# EAGLE design coreAdapter (EAGLE 5.06)
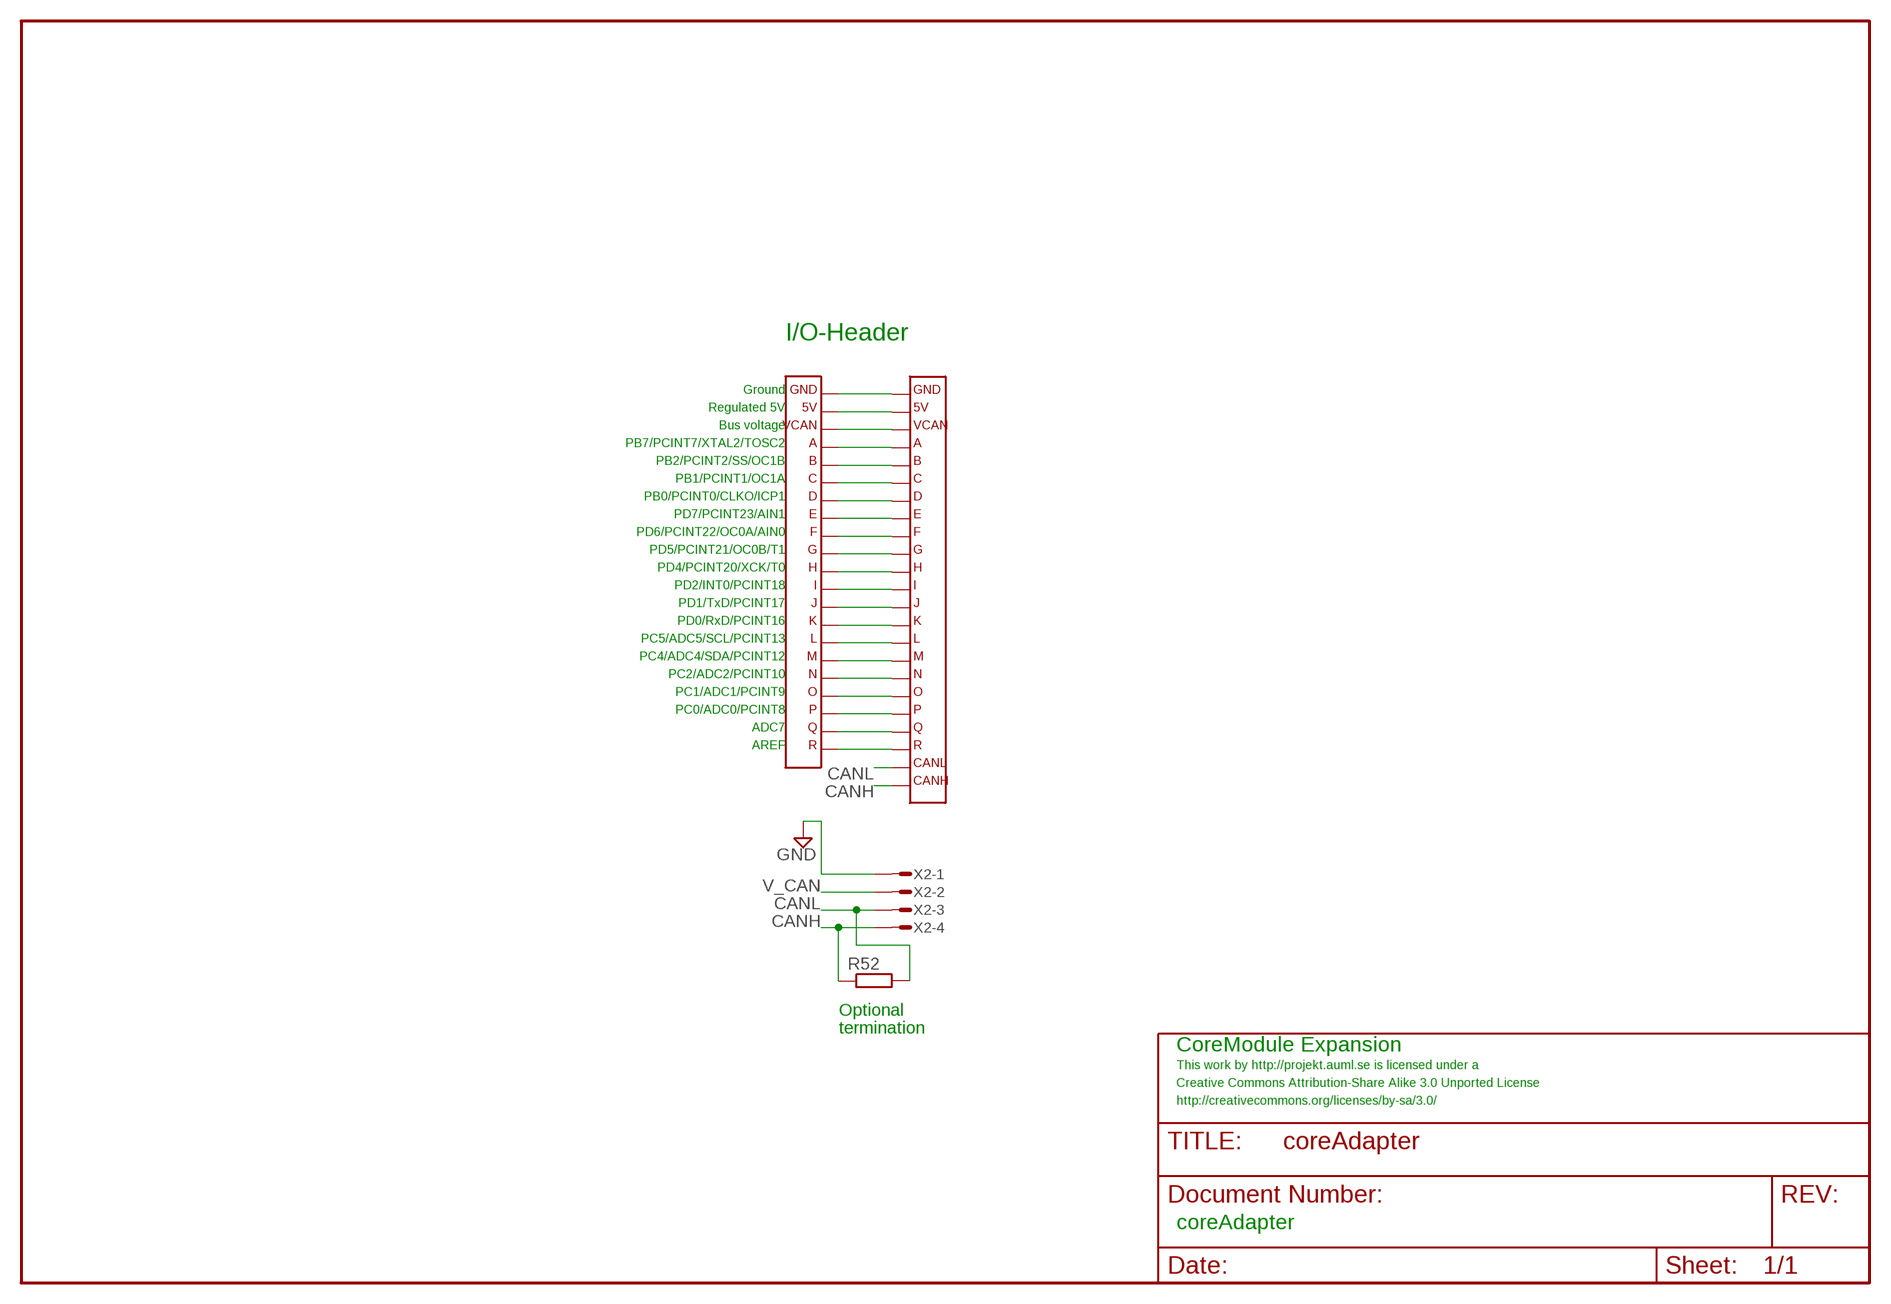
[diagram p0: schematic, sheet 1]

## Parts
R52  R-EUR0603  [R0603]
X1  CORETWO_LAYOUTALLHOLES  [CORETWO_LAYOUT]
X2  MICROMATCH-4  [MICROMATCH-4]
X3  CORE_IOHEADEXP  [CORE_IOHEAD_NOSILC]

## Nets
CANH: R52.1 X1.CANH X2.4
CANL: R52.2 X1.CANL X2.3
EXP_A: X1.A X3.4
EXP_B: X1.B X3.5
EXP_C: X1.C X3.6
EXP_D: X1.D X3.7
EXP_E: X1.E X3.8
EXP_F: X1.F X3.9
EXP_G: X1.G X3.10
EXP_H: X1.H X3.11
EXP_I: X1.I X3.12
EXP_J: X1.J X3.13
EXP_K: X1.K X3.14
EXP_L: X1.L X3.15
EXP_M: X1.M X3.16
EXP_N: X1.N X3.17
EXP_O: X1.O X3.18
EXP_P: X1.P X3.19
EXP_Q: X1.Q X3.20
EXP_R: X1.R X3.21
GND: X1.GND X2.1 X3.1
V_CAN: X1.VCAN X2.2 X3.3
VCC: X1.5V X3.2

## Notes on the sheet
- I/O-Header
- Ground
- Regulated 5V
- Bus voltage
- PB7/PCINT7/XTAL2/TOSC2
- PB2/PCINT2/SS/OC1B
- PB1/PCINT1/OC1A
- PB0/PCINT0/CLKO/ICP1
- PD7/PCINT23/AIN1
- PD6/PCINT22/OC0A/AIN0
- PD5/PCINT21/OC0B/T1
- PD4/PCINT20/XCK/T0
- PD2/INT0/PCINT18
- PD1/TxD/PCINT17
- PD0/RxD/PCINT16
- PC5/ADC5/SCL/PCINT13
- PC4/ADC4/SDA/PCINT12
- PC2/ADC2/PCINT10
- PC1/ADC1/PCINT9
- PC0/ADC0/PCINT8
- ADC7
- AREF
- Optional
- termination
- CoreModule Expansion
- This work by http://projekt.auml.se is licensed under a
- Creative Commons Attribution-Share Alike 3.0 Unported License
- http://creativecommons.org/licenses/by-sa/3.0/
- coreAdapter

## Library data of the parts
R52 = rcl:R-EU
X1 = expboard:CORETWO_LAYOUT
X2 = con-amp-micromatch:MICROMATCH-4: MicroMaTch 4 7-215464-4 / 0-215464-4 Drawing Number C-215464 DDEController.pdf
X3 = expboard:CORE_IOHEAD: CoreCard IO-header for expansion cards

## Board
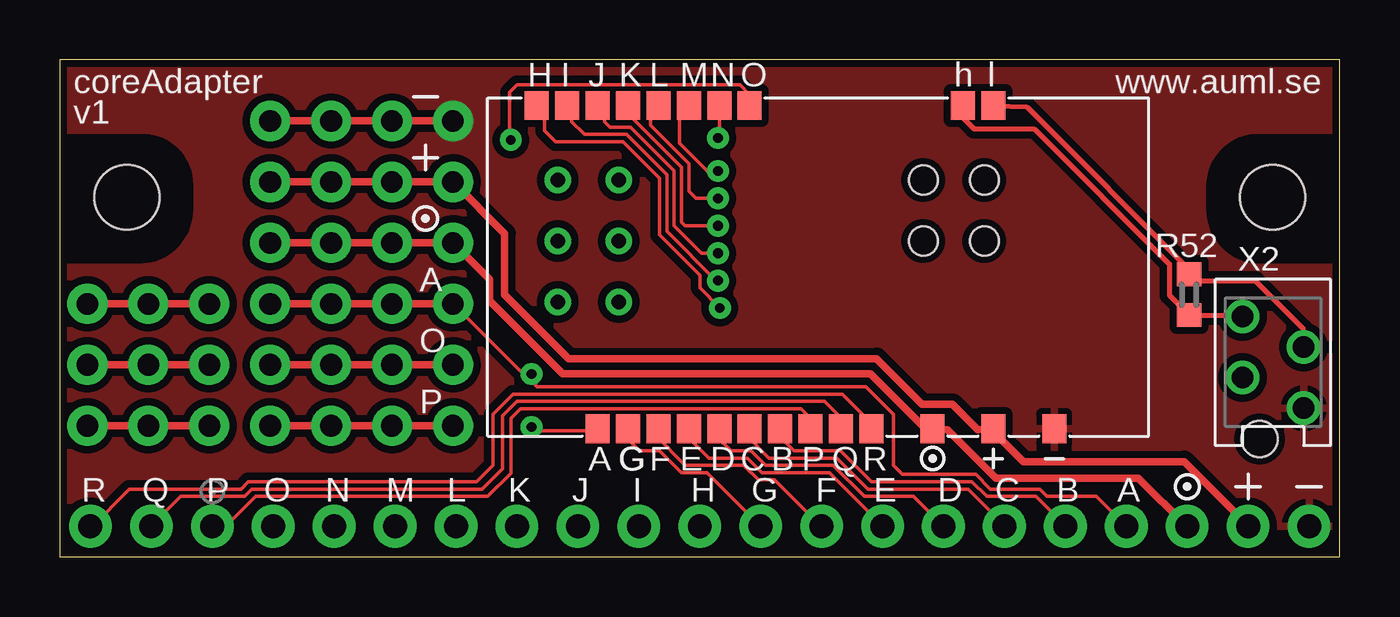
[diagram p1: board, top side]
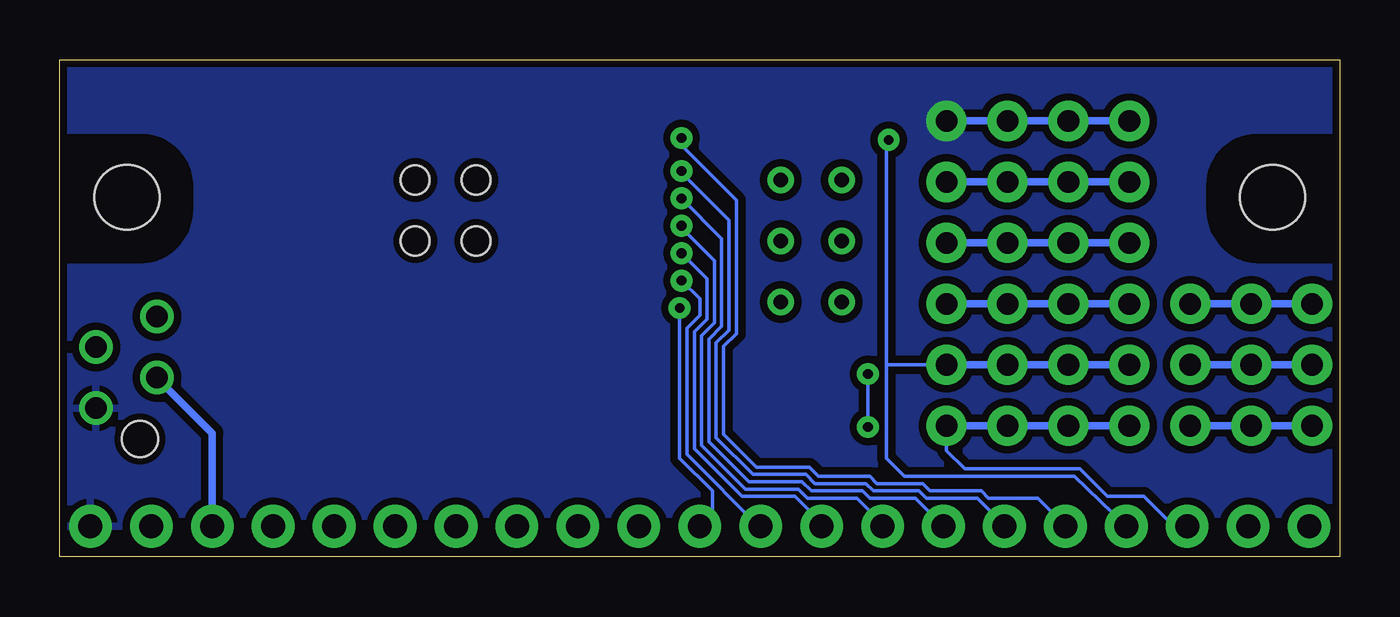
[diagram p2: board, bottom side, seen from below]

Size 53.34 x 20.7 mm. Coordinates in mm from the lower left corner, seen from the top.
Outline: 0,0 53.34,0 53.34,20.7 0,20.7 0,0
Copper layers (1*16): Top 0.035mm / dielectric 1.5mm / Bottom 0.035mm
Design rules "default": minimum track width 6mil, minimum drill 0.4mm, track to track 6mil, track to pad 6mil, pad to pad 6mil, via to via 6mil, smd to smd 6mil, copper to edge 10mil, drill to drill 8mil, minimum pad ring 10mil, minimum via ring 10mil, stop-mask expansion 4mil, vias tented up to drill 18mil, thermal gap 10mil
Holes 2.7 mm at 50.55,14.99 2.79,14.99

### Footprints (pad centres in the part's own frame; a part is rotated, then mirrored left to right if it is on the bottom)
R0603 = smd 0.991 x 1.016: 1 -0.85,0; 2 0.85,0
CORETWO_LAYOUT_CU = smd 1 x 1.2: 5V 7.62,-7.258; A -8.89,-7.258; B -1.27,-7.258; C -2.54,-7.258; CANH 6.35,6.204; CANL 7.62,6.204; D -3.81,-7.258; E -5.08,-7.258; F -6.35,-7.258; G -7.62,-7.258; GND 10.16,-7.258; H -11.43,6.204; I -10.16,6.204; J -8.89,6.204; K -7.62,6.204; L -6.35,6.204; M -5.08,6.204; N -3.81,6.204; O -2.54,6.204; P 0,-7.258; Q 1.27,-7.258; R 2.54,-7.258; VCAN 5.08,-7.258 | drill 0.6 round: P$1 -10.541,3.099; P$2 -8.001,3.099; P$3 -10.541,0.559; P$4 -8.001,0.559; P$5 -8.001,-1.981; P$6 -10.541,-1.981 | hole 1.2: 4.699,3.099; 7.239,3.099; 7.239,0.559; 4.699,0.559
MICROMATCH-4 = drill 0.9 round: 1 1.905,1.27; 2 0.635,-1.27; 3 -0.635,1.27; 4 -1.905,-1.27 | hole 1.5: 3.199,-0.562
CORE_IOHEAD_NOSILC = drill 1 pad 1.778 round: 1 25.4,0; 2 22.86,0; 3 20.32,0; 4 17.78,0; 5 15.24,0; 6 12.7,0; 7 10.16,0; 8 7.62,0; 9 5.08,0; 10 2.54,0; 11 0,0; 12 -2.54,0; 13 -5.08,0; 14 -7.62,0; 15 -10.16,0; 16 -12.7,0; 17 -15.24,0; 18 -17.78,0; 19 -20.32,0; 20 -22.86,0; 21 -25.4,0

### Placement (x,y rotation side)
R52  47.07,10.92 90 top
X1  CORETWO_LAYOUTALLHOLES_CU  [CORETWO_LAYOUT_CU]  31.29,12.6 0 top
X2  50.57,8.1 270 top
X3  26.67,1.27 180 bottom

### Tracks (layer width: path | path; a pad name or v marks a point on that pad's centre or on a via)
CANH
  Top 0.203: X1.CANH 37.64,18.29 38.1,17.83 40.62,17.83 46.25,12.19 46.25,10.9 R52.1 | R52.1 47.09,10.06 | R52.1 49.13,10.07 49.23,9.98 49.25,10.01 X2.4
CANL
  Top 0.203: X1.CANL 40.3,18.75 47.17,11.89 47.07,11.79 R52.2 47.32,11.51 49.84,11.51 51.82,9.53 51.82,8.84 51.89,8.76 51.87,8.74 X2.3
EXP_A  (via drill 0.4 pad 0.25)
  Top 0.152: X1.A 22.36,5.29 22.33,5.26 19.81,5.26 v19.66,5.41 | X3.4 43.2,2.52 41.15,2.52 40.84,2.82 38.79,2.82 38.18,3.43 35.13,3.43 34.75,3.81 34.75,5.94 33.6,7.09 19.89,7.09 19.66,7.32 v19.66,7.62 19.66,7.26 16.38,10.54
  Top 0.305: 16.38,10.54 13.84,10.54
  Bottom 0.152: v19.66,5.41 v19.66,7.62
EXP_B
  Top 0.152: X1.B 30.02,5 30.61,4.42 32.54,4.42 33.83,3.12 38.02,3.12 38.63,2.52 40.69,2.52 41.91,1.29 X3.5
EXP_C
  Top 0.152: X1.C 28.63,5.05 29.57,4.12 32.38,4.12 33.68,2.82 37.87,2.82 39.4,1.29 X3.6
EXP_D
  Top 0.152: X1.D 27.36,5.03 27.96,4.42 28.8,4.42 29.41,3.81 32.23,3.81 33.53,2.52 35.59,2.52 X3.7 36.88,1.22
EXP_E
  Top 0.152: X1.E 26.16,5 27.05,4.12 28.65,4.12 29.26,3.5 32.08,3.5 34.29,1.29 X3.8
EXP_F
  Top 0.152: X1.F 24.82,5.05 26.06,3.81 28.5,3.81 29.11,3.2 29.79,3.2 31.75,1.25 | 31.75,1.25 31.77,1.22 | 31.75,1.25 X3.9
EXP_G
  Top 0.152: X1.G 23.55,5.03 24.16,4.42 24.99,4.42 25.91,3.5 26.98,3.5 X3.10
EXP_H  (via drill 0.4 pad 0.25)
  Top 0.152: X1.H 19.86,18.62 20.19,18.29 20.19,17.75 20.65,17.3 23.47,17.3 24.99,15.77 24.99,13.41 26.67,11.73 26.67,11.2 v27.51,10.36
  Bottom 0.152: X3.11 26.67,1.29 26.14,1.75 26.14,2.74 27.51,4.12 v27.51,10.36
EXP_I  (via drill 0.4 pad 0.25)
  Top 0.152: X1.I 21.13,18.49 21.34,18.29 21.34,18.14 21.87,17.6 23.62,17.6 25.3,15.93 25.3,13.56 27.36,11.51 v27.43,11.51
  Bottom 0.152: v27.43,11.51 26.67,10.74 26.67,10.06 27.2,9.53 27.2,4.27 24.16,1.22 24.13,1.25 X3.12
EXP_J  (via drill 0.4 pad 0.25)
  Top 0.152: X1.J 22.4,18.59 22.71,18.29 22.71,18.14 22.94,17.91 23.77,17.91 25.6,16.08 25.6,13.79 26.75,12.65 v27.43,12.65
  Bottom 0.152: v27.43,12.65 26.36,11.58 26.36,9.91 26.9,9.37 26.9,4.5 24.92,2.52 22.71,2.52 21.57,1.37 21.59,1.35 X3.13
EXP_K  (via drill 0.4 pad 0.25)
  Top 0.152: X1.K 23.67,18.47 25.91,16.23 25.91,13.95 26.06,13.79 v27.43,13.79
  Bottom 0.152: v27.43,13.79 27.43,13.72 26.06,12.34 26.06,9.75 26.59,9.22 26.59,4.65 24.77,2.82 22.55,2.82 22.17,2.44 20.12,2.44 18.97,1.29 19,1.27 X3.14
EXP_L  (via drill 0.4 pad 0.25)
  Top 0.152: X1.L 24.61,18.42 24.61,17.98 26.21,16.38 26.21,15.24 26.52,14.94 v27.43,14.94
  Bottom 0.152: v27.43,14.94 25.76,13.26 25.76,9.6 26.29,9.07 26.29,4.8 24.61,3.12 22.4,3.12 22.02,2.74 19.89,2.74 19.58,2.44 17.68,2.44 X3.15
EXP_M  (via drill 0.4 pad 0.25)
  Top 0.152: X1.M 26.21,18.67 25.83,18.29 25.83,17.22 26.98,16.08 v27.43,16.08
  Bottom 0.152: v27.43,16.08 27.43,16 25.45,14.02 25.45,9.45 25.98,8.91 25.98,4.95 24.46,3.43 22.25,3.43 21.87,3.05 19.74,3.05 19.43,2.74 17.53,2.74 17.22,2.44 15.09,2.44 13.95,1.29 X3.16
EXP_N  (via drill 0.4 pad 0.25)
  Top 0.152: X1.N 27.48,17.5 v27.43,17.45
  Bottom 0.152: v27.43,17.45 27.43,17.14 25.15,14.86 25.15,9.3 25.68,8.76 25.68,5.11 24.31,3.73 22.1,3.73 21.72,3.35 19.58,3.35 19.28,3.05 17.37,3.05 17.07,2.74 14.94,2.74 14.63,2.44 12.57,2.44 11.43,1.29 X3.17
EXP_O  (via drill 0.4 pad 0.25, 0.9 pad 1.68)
  Top 0.152: X1.O 28.75,19.25 28.35,19.66 19.05,19.66 18.75,19.36 18.75,17.4 18.8,17.4 v18.8,17.37
  Bottom 0.152: X3.18 11.05,3.35 18.14,3.35 18.9,4.12 18.9,8 | v18.8,17.37 18.75,17.37 18.9,17.22 18.9,8 | 18.9,8 v16.38,8
EXP_P  (via drill 0.9 pad 1.68)
  Top 0.152: X1.P 31.42,5.64 30.89,6.17 19.2,6.17 18.8,5.77 18.8,3.48 17.83,2.52 8.15,2.52 6.91,1.27 X3.19
  Bottom 0.152: v16.38,5.46 16.38,4.42 15.62,3.66 10.82,3.66 9.68,2.52 8.15,2.52 6.93,1.29 6.4,1.29 6.38,1.27 X3.19
EXP_Q
  Top 0.152: X1.Q 32.69,5.66 31.88,6.48 19.05,6.48 18.44,5.87 18.44,3.66 17.6,2.82 8,2.82 7.7,2.52 5.03,2.52 3.81,1.29 X3.20
EXP_R
  Top 0.152: X1.R 33.71,5.69 32.61,6.78 18.9,6.78 18.06,5.94 18.06,3.81 17.37,3.12 7.85,3.12 7.54,2.82 2.9,2.82 1.29,1.22 1.27,1.25 X3.21
GND  (via drill 0.9 pad 1.68)
  other vias: 16.38,18.16
  pour Bottom (isolate 0.305, rank 3): 0,20.7 53.34,20.7 53.34,17.78 50.04,17.78 arc90 47.62,15.49 47.62,14.48 arc90 50.04,12.06 53.34,12.06 53.34,1.14 0,1.14 0,12.06 3.3,12.06 arc90 5.71,14.48 5.71,15.49 arc90 3.43,17.78 0,17.78
  pour Top (isolate 0.305, rank 3): 0,20.7 53.34,20.7 53.34,17.78 50.04,17.78 arc90 47.62,15.49 47.62,14.48 arc90 50.04,12.06 53.34,12.06 53.34,1.14 0,1.14 0,12.06 3.3,12.06 arc90 5.71,14.48 5.71,15.49 arc90 3.43,17.78 0,17.78
N$109  (via drill 0.9 pad 1.68)
  other vias: 1.14,10.54
N$110  (via drill 0.9 pad 1.68)
  other vias: 1.14,8
N$111  (via drill 0.9 pad 1.68)
  other vias: 1.14,5.46
N$159  (via drill 0.9 pad 1.68)
  other vias: 3.68,10.54
N$160  (via drill 0.9 pad 1.68)
  other vias: 3.68,8
N$161  (via drill 0.9 pad 1.68)
  other vias: 3.68,5.46
N$178
  Bottom 0.305: 1.14,10.54 3.68,10.54
N$179
  Top 0.305: 1.14,10.54 3.68,10.54
N$180
  Bottom 0.305: 1.14,8 3.68,8
N$181
  Top 0.305: 1.14,8 3.68,8
N$182
  Bottom 0.305: 1.14,5.46 3.68,5.46
N$183
  Top 0.305: 1.14,5.46 3.68,5.46
N$208  (via drill 0.9 pad 1.68)
  other vias: 6.22,10.54
N$209  (via drill 0.9 pad 1.68)
  other vias: 6.22,8
N$210  (via drill 0.9 pad 1.68)
  other vias: 6.22,5.46
N$226
  Bottom 0.305: 3.68,10.54 6.22,10.54
N$227
  Top 0.305: 3.68,10.54 6.22,10.54
N$228
  Bottom 0.305: 3.68,8 6.22,8
N$229
  Top 0.305: 3.68,8 6.22,8
N$230
  Bottom 0.305: 3.68,5.46 6.22,5.46
N$231
  Top 0.305: 3.68,5.46 6.22,5.46
N$251  (via drill 0.9 pad 1.68)
  other vias: 8.76,18.16
N$252  (via drill 0.9 pad 1.68)
  other vias: 8.76,15.62
N$253  (via drill 0.9 pad 1.68)
  other vias: 8.76,13.08
N$254  (via drill 0.9 pad 1.68)
  other vias: 8.76,10.54
N$255  (via drill 0.9 pad 1.68)
  other vias: 8.76,8
N$256  (via drill 0.9 pad 1.68)
  other vias: 8.76,5.46
N$297  (via drill 0.9 pad 1.68)
  other vias: 11.3,18.16
N$298  (via drill 0.9 pad 1.68)
  other vias: 11.3,15.62
N$299  (via drill 0.9 pad 1.68)
  other vias: 11.3,13.08
N$300  (via drill 0.9 pad 1.68)
  other vias: 11.3,10.54
N$301  (via drill 0.9 pad 1.68)
  other vias: 11.3,8
N$302  (via drill 0.9 pad 1.68)
  other vias: 11.3,5.46
N$312
  Bottom 0.305: 8.76,18.16 11.3,18.16
N$313
  Top 0.305: 8.76,18.16 11.3,18.16
N$314
  Bottom 0.305: 8.76,15.62 11.3,15.62
N$315
  Top 0.305: 8.76,15.62 11.3,15.62
N$316
  Bottom 0.305: 8.76,13.08 11.3,13.08
N$317
  Top 0.305: 8.76,13.08 11.3,13.08
N$318
  Bottom 0.305: 8.76,10.54 11.3,10.54
N$319
  Top 0.305: 8.76,10.54 11.3,10.54
N$320
  Bottom 0.305: 8.76,8 11.3,8
N$321
  Top 0.305: 8.76,8 11.3,8
N$322
  Bottom 0.305: 8.76,5.46 11.3,5.46
N$323
  Top 0.305: 8.76,5.46 11.3,5.46
N$343  (via drill 0.9 pad 1.68)
  other vias: 13.84,18.16
N$344  (via drill 0.9 pad 1.68)
  other vias: 13.84,15.62
N$345  (via drill 0.9 pad 1.68)
  other vias: 13.84,13.08
N$346  (via drill 0.9 pad 1.68)
  other vias: 13.84,10.54
N$347  (via drill 0.9 pad 1.68)
  other vias: 13.84,8
N$348  (via drill 0.9 pad 1.68)
  other vias: 13.84,5.46
N$358
  Bottom 0.305: 11.3,18.16 13.84,18.16
N$359
  Top 0.305: 11.3,18.16 13.84,18.16
N$360
  Bottom 0.305: 11.3,15.62 13.84,15.62
N$361
  Top 0.305: 11.3,15.62 13.84,15.62
N$362
  Bottom 0.305: 11.3,13.08 13.84,13.08
N$363
  Top 0.305: 11.3,13.08 13.84,13.08
N$364
  Bottom 0.305: 11.3,10.54 13.84,10.54
N$365
  Top 0.305: 11.3,10.54 13.84,10.54
N$366
  Bottom 0.305: 11.3,8 13.84,8
N$367
  Top 0.305: 11.3,8 13.84,8
N$368
  Bottom 0.305: 11.3,5.46 13.84,5.46
N$369
  Top 0.305: 11.3,5.46 13.84,5.46
N$395  (via drill 0.9 pad 1.68)
  other vias: 16.38,10.54
N$407
  Bottom 0.305: 13.84,18.16 16.38,18.16
N$408
  Top 0.305: 13.84,18.16 16.38,18.16
N$409
  Bottom 0.305: 13.84,15.62 16.38,15.62
N$410
  Top 0.305: 13.84,15.62 16.38,15.62
N$411
  Bottom 0.305: 13.84,13.08 16.38,13.08
N$412
  Top 0.305: 13.84,13.08 16.38,13.08
N$413
  Bottom 0.305: 13.84,10.54 16.38,10.54
N$415
  Bottom 0.305: 13.84,8 16.38,8
N$416
  Top 0.305: 13.84,8 16.38,8
N$417
  Bottom 0.305: 13.84,5.46 16.38,5.46
N$418
  Top 0.305: 13.84,5.46 16.38,5.46
V_CAN  (via drill 0.9 pad 1.68)
  Top 0.305: X3.3 46.97,1.27 44.96,3.28 39.01,3.28 37,5.29 X1.VCAN 36.11,5.29 33.78,7.62 20.95,7.62 17.91,10.67 17.91,11.56 v16.38,13.08
  Bottom 0.305: X3.3 46.99,5.16 X2.2
VCC  (via drill 0.9 pad 1.68)
  Top 0.305: 49.55,1.27 49.61,1.22 | 49.55,1.27 X3.2 | 49.55,1.27 46.86,3.96 40.16,3.96 38.91,5.21 X1.5V 38.27,5.29 37.21,6.35 35.94,6.35 34.04,8.26 21.21,8.26 18.54,10.92 18.54,13.46 v16.38,15.62

### Text on the board
tPlace: coreAdapter | www.auml.se | v1 | A | O | P | R | Q | P | O | N | M | L | K | J | I | H | G | F | E | D | C | B | A
Document: Creative Commons Attribution-Share Alike 3.0 Unported License | This work by http://projekt.auml.se is licensed under a | http://creativecommons.org/licenses/by-sa/3.0/ | Expansion will be mounted bottom to bottom with CoreModule adaptercard
tDocu: - | + | A | B | C | D | E | F | G | H | I | J | K | L | M | N | O | P | Q | R